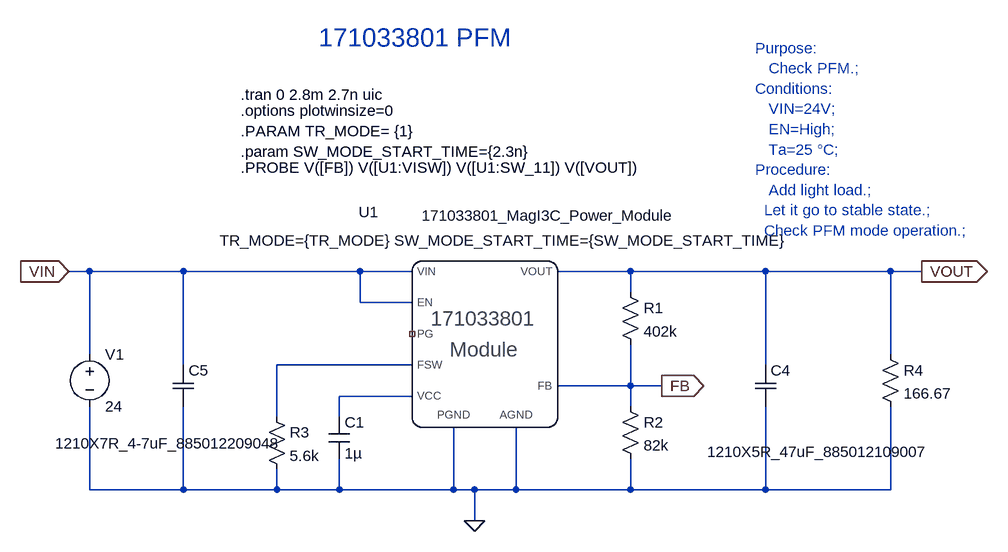
[diagram p0: schematic 171033801 PFM.asc]
171033801 PFM.asc, the LTspice schematic file:
Version 4
SHEET 1 1600 680
WIRE -384 48 -416 48
WIRE -240 48 -384 48
WIRE 32 48 -240 48
WIRE 112 48 32 48
WIRE 448 48 336 48
WIRE 656 48 448 48
WIRE 848 48 656 48
WIRE 896 48 848 48
WIRE 448 80 448 48
WIRE 32 96 32 48
WIRE 112 96 32 96
WIRE -384 176 -384 48
WIRE 848 176 848 48
WIRE -240 192 -240 48
WIRE 112 192 -96 192
WIRE 656 192 656 48
WIRE 448 224 448 160
WIRE 448 224 336 224
WIRE 496 224 448 224
WIRE 112 240 0 240
WIRE 448 256 448 224
WIRE -96 272 -96 192
WIRE 0 272 0 240
WIRE -384 384 -384 256
WIRE -240 384 -240 256
WIRE -240 384 -384 384
WIRE -96 384 -96 352
WIRE -96 384 -240 384
WIRE 0 384 0 336
WIRE 0 384 -96 384
WIRE 176 384 176 288
WIRE 176 384 0 384
WIRE 208 384 176 384
WIRE 272 384 272 288
WIRE 272 384 208 384
WIRE 448 384 448 336
WIRE 448 384 272 384
WIRE 656 384 656 256
WIRE 656 384 448 384
WIRE 848 384 848 256
WIRE 848 384 656 384
WIRE 208 432 208 384
FLAG 208 432 0
FLAG -416 48 VIN
IOPIN -416 48 In
FLAG 896 48 VOUT
IOPIN 896 48 Out
FLAG 496 224 FB
IOPIN 496 224 Out
SYMBOL res 432 64 R0
SYMATTR InstName R1
SYMATTR Value 402k
SYMBOL res 432 240 R0
SYMATTR InstName R2
SYMATTR Value 82k
SYMBOL res -112 256 R0
SYMATTR InstName R3
SYMATTR Value 5.6k
SYMBOL cap -16 272 R0
SYMATTR InstName C1
SYMATTR Value 1µ
SYMATTR SpiceLine Rser=7.13m Lser=257p
SYMBOL voltage -384 160 R0
WINDOW 123 0 0 Left 0
WINDOW 39 0 0 Left 0
SYMATTR InstName V1
SYMATTR Value 24
SYMBOL res 832 160 R0
SYMATTR InstName R4
SYMATTR Value 166.67
SYMBOL Contrib\\Wurth\\Capacitors\\MLCC\\WCAP-CSGP\\WCAP-CSGP_10V_DCbias 640 192 R0
WINDOW 38 -74 134 Left 2
SYMATTR SpiceModel 1210X5R_47uF_885012109007
SYMATTR InstName C4
SYMBOL Contrib\\Wurth\\Capacitors\\MLCC\\WCAP-CSGP\\WCAP-CSGP_50V_DCbias -256 192 R0
WINDOW 38 -181 121 Left 2
SYMATTR SpiceModel 1210X7R_4-7uF_885012209048
SYMATTR InstName C5
SYMBOL 171033801_MagI3C_Power_Module 256 64 R0
SYMATTR InstName U1
TEXT -32 -312 Left 4 ;171033801 PFM
TEXT 640 -296 Left 2 ;Purpose: \n   Check PFM.; \nConditions: \n   VIN=24V; \n   EN=High; \n   Ta=25 °C; \nProcedure: \n   Add light load.;\n  Let it go to stable state.;\n  Check PFM mode operation.;
TEXT -152 -224 Left 2 !.tran 0 2.8m 2.7n uic
TEXT -152 -200 Left 2 !.options plotwinsize=0
TEXT -152 -168 Left 2 !.PARAM TR_MODE= {1}\n.param SW_MODE_START_TIME={2.3n}
TEXT -152 -112 Left 2 !.PROBE V([FB]) V([U1:VISW]) V([U1:SW_11]) V([VOUT])

The netlist it stands for:
* 171033801 PFM.asc
R1 VOUT FB 402k
R2 FB 0 82k
R3 N001 0 5.6k
C1 N002 0 1µ Rser=7.13m Lser=257p
V1 VIN 0 24
R4 VOUT 0 166.67
XC4 VOUT 0 1210X5R_47uF_885012109007  ; pins A B
XC5 VIN 0 1210X7R_4-7uF_885012209048  ; pins A B
XU1 VOUT FB VIN VIN NC_01 N001 N002 0 0 171033801_MagI3C_Power_Module TR_MODE={TR_MODE} SW_MODE_START_TIME={SW_MODE_START_TIME}  ; pins VOUT FB VIN EN PG FSW VCC PGND AGND
* 171033801 PFM
* Purpose:
*    Check PFM.;
* Conditions:
*    VIN=24V;
*    EN=High;
*    Ta=25 °C;
* Procedure:
*    Add light load.;
*   Let it go to stable state.;
*   Check PFM mode operation.;
.tran 0 2.8m 2.7n uic
.options plotwinsize=0
.PARAM TR_MODE= {1}
.param SW_MODE_START_TIME={2.3n}
.PROBE V([FB]) V([U1:VISW]) V([U1:SW_11]) V([VOUT])
.lib WCAP-CSGP_10V_DCbias.lib
.lib WCAP-CSGP_50V_DCbias.lib
.lib 171033801.lib
.backanno
.end